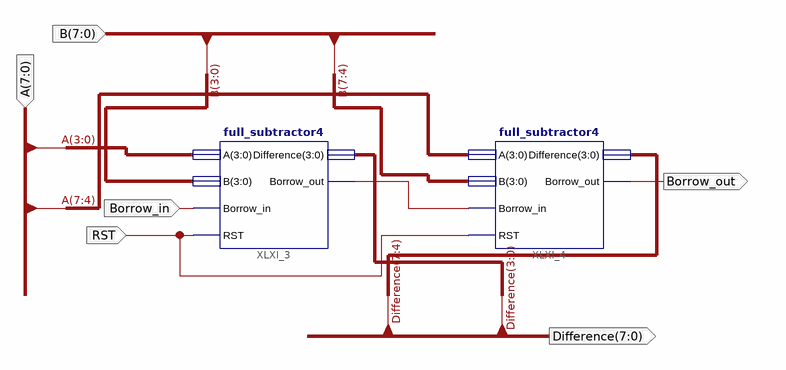
[diagram p0: schematic sheet 1]
// Xilinx ISE schematic full_subtractor8.sch (artix7) as structural Verilog: 2 symbols, 6 ports
module full_subtractor8 (
  input  Borrow_in,
  input  RST,
  input  [7:0] A,
  input  [7:0] B,
  output Borrow_out,
  output [7:0] Difference
);

  wire XLXN_5;

  full_subtractor4 XLXI_3 (
    .A(A[3:0]), .B(B[3:0]), .Borrow_in(Borrow_in), .Borrow_out(XLXN_5), .Difference(Difference[3:0]),
    .RST(RST));
  full_subtractor4 XLXI_4 (
    .A(A[7:4]), .B(B[7:4]), .Borrow_in(XLXN_5), .Borrow_out(Borrow_out), .Difference(Difference[7:4]),
    .RST(RST));
endmodule
